# EAGLE schematic DAU_Kupplung_3phasig_V1_2 (EAGLE 6.1)
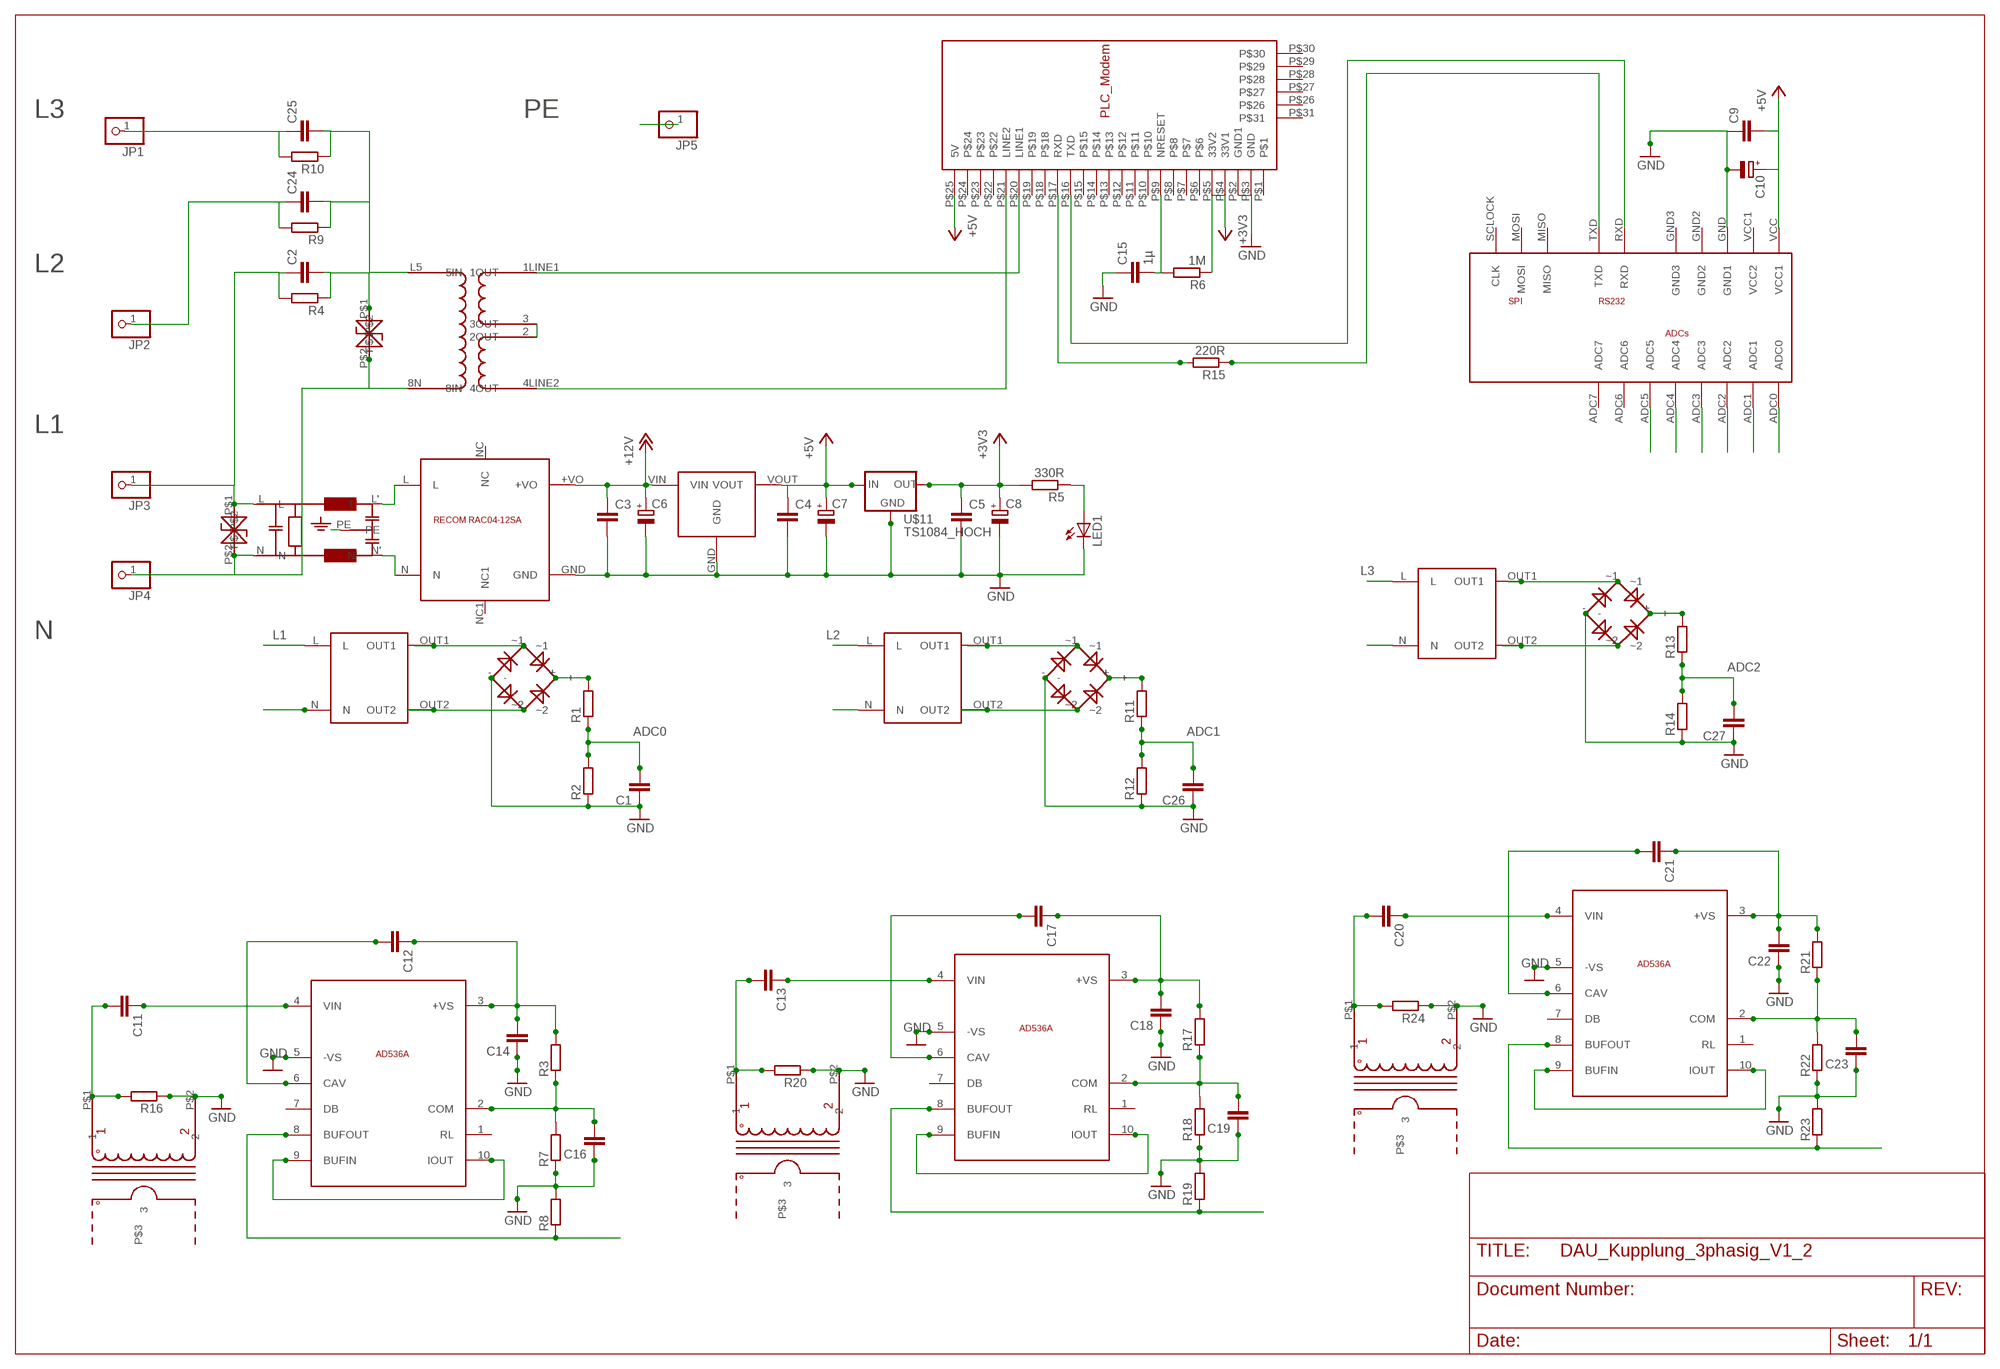
[diagram p0: schematic, sheet 1]

## Parts
C1  C2,5-3  [C2.5-3]
C2  C-EU225-087X268  [C225-087X268]
C3  C-EU025-040X050  [C025-040X050]
C4  C-EU025-040X050  [C025-040X050]
C5  C-EU025-040X050  [C025-040X050]
C6  CPOL-EUE2.5-6  [E2,5-6]
C7  CPOL-EUE2.5-6  [E2,5-6]
C8  CPOL-EUE2.5-6  [E2,5-6]
C9  C-EU025-040X050  [C025-040X050]
C10  CPOL-EUE2,5-6E  [E2,5-6E]
C11  C2,5-3  [C2.5-3]
C12  C2,5-3  [C2.5-3]
C13  C2,5-3  [C2.5-3]
C14  C2,5-3  [C2.5-3]
C15  1µ  C-EU025-040X050  [C025-040X050]
C16  C2,5-3  [C2.5-3]
C17  C2,5-3  [C2.5-3]
C18  C2,5-3  [C2.5-3]
C19  C2,5-3  [C2.5-3]
C20  C2,5-3  [C2.5-3]
C21  C2,5-3  [C2.5-3]
C22  C2,5-3  [C2.5-3]
C23  C2,5-3  [C2.5-3]
C24  C-EU225-087X268  [C225-087X268]
C25  C-EU225-087X268  [C225-087X268]
C26  C2,5-3  [C2.5-3]
C27  C2,5-3  [C2.5-3]
JP1  PINHD-1X1  [1X01]
JP2  PINHD-1X1  [1X01]
JP3  PINHD-1X1  [1X01]
JP4  PINHD-1X1  [1X01]
JP5  PINHD-1X1  [1X01]
LED1  LEDSQR2X5  [LED2X5]
R1  R-EU_0204/7  [0204/7]
R2  R-EU_0204/7  [0204/7]
R3  R-EU_0204/7  [0204/7]
R4  R-EU_0204/7  [0204/7]
R5  330R  R-EU_0204/7  [0204/7]
R6  1M  R-EU_0204/7  [0204/7]
R7  R-EU_0204/7  [0204/7]
R8  R-EU_0204/7  [0204/7]
R9  R-EU_0204/7  [0204/7]
R10  R-EU_0204/7  [0204/7]
R11  R-EU_0204/7  [0204/7]
R12  R-EU_0204/7  [0204/7]
R13  R-EU_0204/7  [0204/7]
R14  R-EU_0204/7  [0204/7]
R15  220R  R-EU_0204/7  [0204/7]
R16  R-EU_0204/7  [0204/7]
R17  R-EU_0204/7  [0204/7]
R18  R-EU_0204/7  [0204/7]
R19  R-EU_0204/7  [0204/7]
R20  R-EU_0204/7  [0204/7]
R21  R-EU_0204/7  [0204/7]
R22  R-EU_0204/7  [0204/7]
R23  R-EU_0204/7  [0204/7]
R24  R-EU_0204/7  [0204/7]
TSV1  TSV  [TSV]
TSV2  TSV  [TSV]
U$1  RECOM_RAC04_12SA  [RAC04_12SA]
U$2  SICHERHEITSTRAFO  [TRAFO_0,35VA]
U$3  ADUC831_MINIMUM  [ADUC_MINIMUM]
U$4  MODEMSTECKER  [MODEM_FUSS]
U$5  PLC_UEBERTRAGER_V2  [PLC-UEBERTRAGER_V2]
U$6  AC1010  [AC1010]
U$7  AC1010  [AC1010]
U$8  RECTIFIER  [RECTIFIER]
U$10  RECOM_785_05  [RECOM785X]
U$11  TS1084_HOCH  [TS1084_HOCH]
U$12  AD536  [TO100_10PIN]
U$13  AD536  [TO100_10PIN]
U$14  AC1010  [AC1010]
U$15  AD536  [TO100_10PIN]
U$16  SICHERHEITSTRAFO  [TRAFO_0,35VA]
U$17  RECTIFIER  [RECTIFIER]
U$18  SICHERHEITSTRAFO  [TRAFO_0,35VA]
U$19  RECTIFIER  [RECTIFIER]
U$20  NETZFILTER_05_A  [NETZFILTER]

## Nets
+3V3: C5.1 C8.+ R5.2 R6.1 U$4.P$4(33V1) U$4.P$5(33V2) U$11.OUT
+5V: C4.1 C7.+ C9.2 C10.+ U$3.VCC(VCC1) U$4.P$25(5V) U$10.VOUT U$11.IN
+12V: C3.1 C6.+ U$1.+VO U$10.VIN
ADC0: C1.2 R1.1 R2.2 U$3.ADC0
ADC1: C26.2 R11.1 R12.2 U$3.ADC1
ADC2: C27.2 R13.1 R14.2 U$3.ADC2
ADC3: R8.1 U$3.ADC3 U$13.8(BUFOUT)
ADC4: R19.1 U$3.ADC4 U$12.8(BUFOUT)
ADC5: R23.1 U$3.ADC5 U$15.8(BUFOUT)
GND: C1.1 C3.2 C4.2 C5.2 C6.- C7.- C8.- C9.1 C10.- C14.1 C15.1 C16.1 C18.1 C19.1 C22.1 C23.1 C26.1 C27.1 LED1.K(C) R2.1 R7.1 R8.2 R12.1 R14.1 R16.1 R18.1 R19.2 R20.1 R22.1 R23.2 R24.1 U$1.GND U$3.GND(GND1) U$4.P$2(GND1) U$4.P$3(GND) U$6.P$2 U$7.P$2 U$8.- U$10.GND U$11.GND U$12.5(-VS) U$13.5(-VS) U$14.P$2 U$15.5(-VS) U$17.- U$19.-
L1: C2.1 JP3.1 R4.2 TSV1.P$1 U$2.L U$20.L
L2: C24.1 JP2.1 R9.2 U$16.L
L3: C25.1 JP1.1 R10.2 U$18.L
N: JP4.1 TSV1.P$2 TSV2.P$2 U$2.N U$5.8N(8IN) U$16.N U$18.N U$20.N
N$1: R15.2 U$4.P$17(RXD)
N$2: C11.2 R16.2 U$6.P$1
N$3: C11.1 U$13.4(VIN)
N$4: U$2.OUT1 U$8.~1
N$5: U$4.P$20(LINE1) U$5.1LINE1(1OUT)
N$6: U$13.9(BUFIN) U$13.10(IOUT)
N$7: R1.2 U$8.+
N$9: U$2.OUT2 U$8.~2
N$10: R11.2 U$17.+
N$11: U$16.OUT1 U$17.~1
N$12: U$16.OUT2 U$17.~2
N$13: U$4.P$21(LINE2) U$5.4LINE2(4OUT)
N$14: R15.1 U$3.TXD
N$15: U$3.RXD U$4.P$16(TXD)
N$16: U$1.L U$20.L'
N$17: C16.2 R3.1 R7.2 U$13.2(COM)
N$18: C12.1 C14.2 R3.2 U$13.3(+VS)
N$19: LED1.A R5.1
N$20: C15.2 R6.2 U$4.P$9(NRESET)
N$21: C12.2 U$13.6(CAV)
N$22: C13.2 R20.2 U$7.P$1
N$23: C13.1 U$12.4(VIN)
N$24: U$12.9(BUFIN) U$12.10(IOUT)
N$26: C2.2 C24.2 C25.2 R4.1 R9.1 R10.1 TSV2.P$1 U$5.L5(5IN)
N$27: C19.2 R17.1 R18.2 U$12.2(COM)
N$28: C17.1 C18.2 R17.2 U$12.3(+VS)
N$29: C17.2 U$12.6(CAV)
N$30: C20.2 R24.2 U$14.P$1
N$31: C20.1 U$15.4(VIN)
N$32: U$15.9(BUFIN) U$15.10(IOUT)
N$33: U$5.2(2OUT) U$5.3(3OUT)
N$34: R13.2 U$19.+
N$35: U$18.OUT1 U$19.~1
N$36: U$18.OUT2 U$19.~2
N$38: C23.2 R21.1 R22.2 U$15.2(COM)
N$39: C21.1 C22.2 R21.2 U$15.3(+VS)
N$40: C21.2 U$15.6(CAV)
N$41: U$1.N U$20.N'
PE: JP5.1 U$20.PE
Unconnected: U$1.NC U$1.NC1 U$3.ADC6 U$3.ADC7 U$3.GND2 U$3.GND3 U$3.MISO U$3.MOSI U$3.SCLOCK(CLK) U$3.VCC1(VCC2) U$4.P$1 U$4.P$6 U$4.P$7 U$4.P$8 U$4.P$10 U$4.P$11 U$4.P$12 U$4.P$13 U$4.P$14 U$4.P$15 U$4.P$18 U$4.P$19 U$4.P$22 U$4.P$23 U$4.P$24 U$4.P$26 U$4.P$27 U$4.P$28 U$4.P$29 U$4.P$30 U$4.P$31 U$6.P$3 U$7.P$3 U$12.1(RL) U$12.7(DB) U$13.1(RL) U$13.7(DB) U$14.P$3 U$15.1(RL) U$15.7(DB)

## Notes on the sheet
- L3 | PE
- L2
- L1
- L3
- N | L1 | L2
- ADC2
- ADC0 | ADC1

## Library data of the parts
C1 C11-C14 C16-C23 C26 C27 = capacitor-wima:C: CAPACITOR naming: grid - package width
C2-C5 C15 C24 C25 = resistor:C-EU: CAPACITOR, European symbol
C6-C8 = resistor:CPOL-EU: POLARIZED CAPACITOR, European symbol
C9 = rcl:C-EU: CAPACITOR, European symbol
C10 = rcl:CPOL-EU: POLARIZED CAPACITOR, European symbol
JP1-JP5 = pinhead:PINHD-1X1: PIN HEADER
LED1 = led:LED: LED OSRAM: - CHIPLED LG R971, LG N971, LY N971, LG Q971, LY Q971, LO R971, LY R971 LH N974, LH R974 LS Q976, LO Q976, LY Q976 LO Q996 - Hyper CHIPLED LW Q18S LB Q993, LB Q99A, LB R99A - SideLED LS A670, LO A670, LY A670, LG A670, LP A670 LB A673, LV A673, LT A673, LW A673 LH A674 LY A675 LS A676, LA A676, LO A676, LY A676, LW A676 LS A679, LY A679, LG A679 - Hyper Micro SIDELED® LS Y876, LA Y876, LO Y876, LY Y876 LT Y87S - SmartLED LW L88C, LW L88S LB L89C, LB L89S, LG L890 LS L89K, LO L89K, LY L89K LS L896, LA L896, LO L896, LY L896 - TOPLED LS T670, LO T670, LY T670, LG T670, LP T670 LSG T670, LSP T670, LSY T670, LOP T670, LYG T670 LG T671, LOG T671, LSG T671 LB T673, LV T673, LT T673, LW T673 LH T674 LS T676, LA T676, LO T676, LY T676, LB T676, LH T676, LSB T676, LW T676 LB T67C, LV T67C, LT T67C, LS T67K, LO T67K, LY T67K, LW E67C LS E67B, LA E67B, LO E67B, LY E67B, LB E67C, LV E67C, LT E67C LW T67C LS T679, LY T679, LG T679 LS T770, LO T770, LY T770, LG T770, LP T770 LB T773, LV T773, LT T773, LW T773 LH T774 LS E675, LA E675, LY E675, LS T675 LS T776, LA T776, LO T776, LY T776, LB T776 LHGB T686 LT T68C, LB T68C - Hyper Mini TOPLED® LB M676 - Mini TOPLED Santana® LG M470 LS M47K, LO M47K, LY M47K Source: http://www.osram.convergy.de LUXEON: - LUMILED® LXK2-PW12-R00, LXK2-PW12-S00, LXK2-PW14-U00, LXK2-PW14-V00 LXK2-PM12-R00, LXK2-PM12-S00, LXK2-PM14-U00 LXK2-PE12-Q00, LXK2-PE12-R00, LXK2-PE12-S00, LXK2-PE14-T00, LXK2-PE14-U00 LXK2-PB12-K00, LXK2-PB12-L00, LXK2-PB12-M00, LXK2-PB14-N00, LXK2-PB14-P00, LXK2-PB14-Q00 LXK2-PR12-L00, LXK2-PR12-M00, LXK2-PR14-Q00, LXK2-PR14-R00 LXK2-PD12-Q00, LXK2-PD12-R00, LXK2-PD12-S00 LXK2-PH12-R00, LXK2-PH12-S00 LXK2-PL12-P00, LXK2-PL12-Q00, LXK2-PL12-R00 Source: www.luxeon.com KINGBRIGHT: KA-3528ASYC Source: www.kingbright.com
R1-R24 = resistor:R-EU_: RESISTOR, European symbol
TSV1 TSV2 = ADS:TSV
U$1 = ADS:RECOM_RAC04_12SA
U$2 U$16 U$18 = ADS:SICHERHEITSTRAFO
U$3 = ADS_ADUCBoards:ADUC831_MINIMUM
U$4 = ADS:MODEMSTECKER
U$5 = ADS1:PLC_UEBERTRAGER_V2
U$6 U$7 U$14 = ADS:AC1010
U$8 U$17 U$19 = ADS:RECTIFIER
U$10 = ADS:RECOM_785_05
U$11 = ADS:TS1084_HOCH
U$12 U$13 U$15 = ADS:AD536
U$20 = ADS:NETZFILTER_05_A